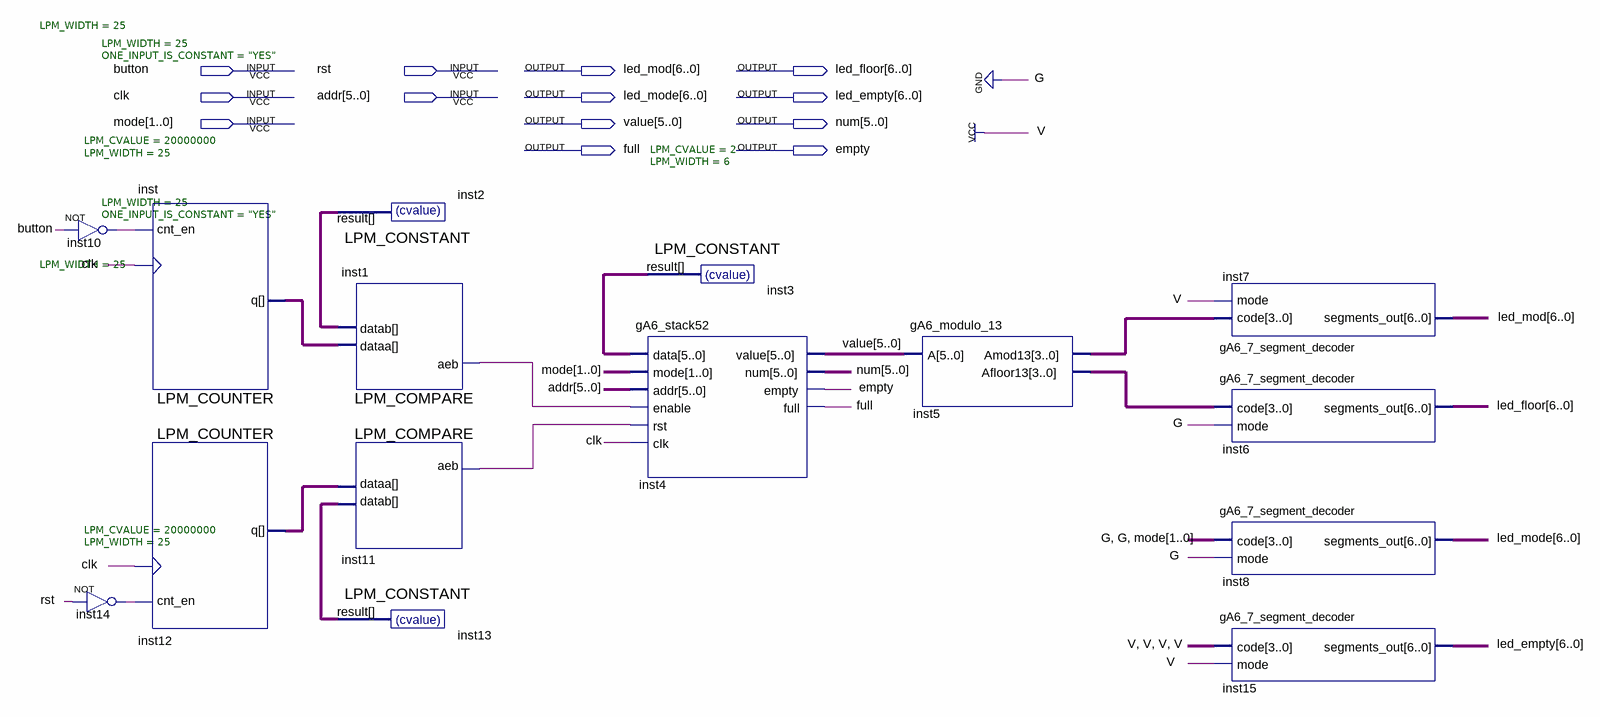
[diagram p0: schematic sheet]
// Quartus schematic gA6_testbed.bdf as structural Verilog: 15 symbols, 13 pins
module gA6_testbed (
  input  button,
  input  rst,
  input  clk,
  input  [5:0] addr,
  input  [1:0] mode,
  output [6:0] led_mod,
  output [6:0] led_floor,
  output [6:0] led_mode,
  output [6:0] led_empty,
  output [5:0] value,
  output [5:0] num,
  output full,
  output empty
);

  wire inst1_aeb, inst10_out, inst11_aeb, inst14_out;
  wire [3:0] inst5_afloor13, inst5_amod13;
  wire [5:0] inst3_result;
  wire [24:0] inst2_result, inst12_q, inst13_result, inst_q;

  not inst10 (inst10_out, button);
  not inst14 (inst14_out, rst);
  LPM_COUNTER #(.LPM_WIDTH(25)) inst (.clock(clk), .cnt_en(inst10_out), .q(inst_q));
  LPM_COUNTER #(.LPM_WIDTH(25)) inst12 (.clock(clk), .cnt_en(inst14_out), .q(inst12_q));
  LPM_CONSTANT #(.LPM_CVALUE(20000000), .LPM_WIDTH(25)) inst2 (.result(inst2_result));
  LPM_COMPARE #(.LPM_WIDTH(25), .ONE_INPUT_IS_CONSTANT("YES")) inst1 (
    .dataa(inst_q), .datab(inst2_result), .aeb(inst1_aeb));
  LPM_COMPARE #(.LPM_WIDTH(25), .ONE_INPUT_IS_CONSTANT("YES")) inst11 (
    .dataa(inst12_q), .datab(inst13_result), .aeb(inst11_aeb));
  LPM_CONSTANT #(.LPM_CVALUE(20000000), .LPM_WIDTH(25)) inst13 (.result(inst13_result));
  LPM_CONSTANT #(.LPM_CVALUE(2), .LPM_WIDTH(6)) inst3 (.result(inst3_result));
  gA6_stack52 inst4 (
    .data(inst3_result), .mode(mode), .addr(addr), .enable(inst1_aeb), .rst(inst11_aeb), .clk(clk),
    .value(value), .num(num), .empty(empty), .full(full));
  gA6_modulo_13 inst5 (.A(value), .Amod13(inst5_amod13), .Afloor13(inst5_afloor13));
  gA6_7_segment_decoder inst7 (.code(inst5_amod13), .mode(1'b1), .segments_out(led_mod));
  gA6_7_segment_decoder inst6 (.code(inst5_afloor13), .mode(1'b0), .segments_out(led_floor));
  gA6_7_segment_decoder inst8 (.code({2'b00, mode}), .mode(1'b0), .segments_out(led_mode));
  gA6_7_segment_decoder inst15 (.code(4'b1111), .mode(1'b1), .segments_out(led_empty));
endmodule
